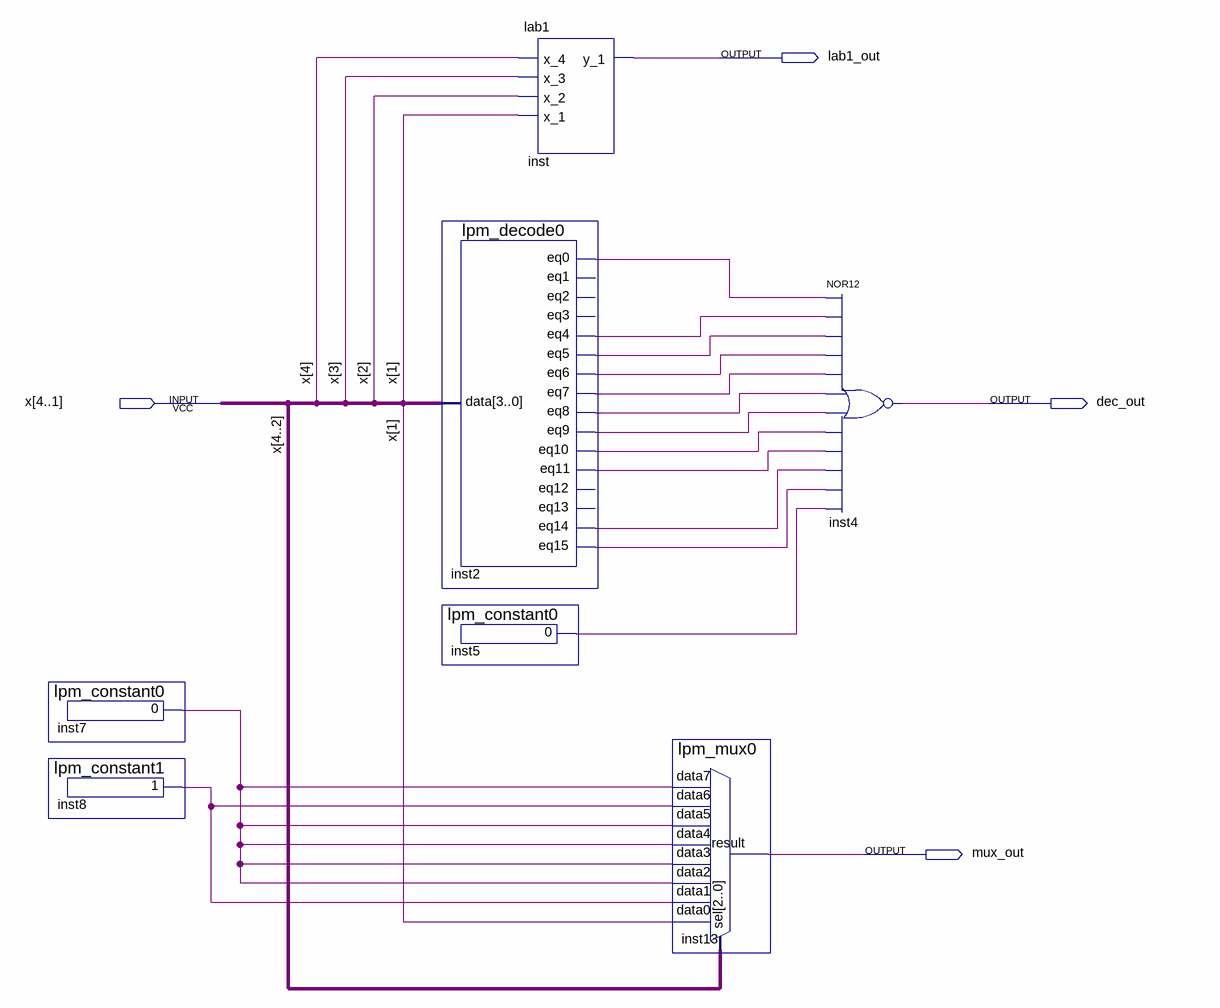
[diagram p0: schematic sheet]
// Quartus schematic lab2_1.bdf as structural Verilog: 7 symbols, 4 pins
module lab2_1 (
  input  [4:1] x,
  output lab1_out,
  output dec_out,
  output mux_out
);

  wire inst2_eq0, inst2_eq4, inst2_eq5, inst2_eq6, inst2_eq7, inst2_eq8, inst2_eq9, inst2_eq10, inst2_eq11,
       inst2_eq14, inst2_eq15, inst5_result, inst7_result, inst8_result;

  lpm_constant0 inst7 (.result(inst7_result));
  lpm_constant1 inst8 (.result(inst8_result));
  lpm_decode0 inst2 (
    .data(x), .eq0(inst2_eq0), .eq4(inst2_eq4), .eq5(inst2_eq5), .eq6(inst2_eq6), .eq7(inst2_eq7),
    .eq8(inst2_eq8), .eq9(inst2_eq9), .eq10(inst2_eq10), .eq11(inst2_eq11), .eq14(inst2_eq14),
    .eq15(inst2_eq15));  // open: eq1, eq2, eq3, eq12, eq13
  lpm_constant0 inst5 (.result(inst5_result));
  lab1 inst (.x_4(x[4]), .x_3(x[3]), .x_2(x[2]), .x_1(x[1]), .y_1(lab1_out));
  lpm_mux0 inst13 (
    .data7(inst7_result), .data6(inst8_result), .data5(inst7_result), .data4(inst7_result),
    .data3(inst7_result), .data2(inst7_result), .data1(inst8_result), .data0(x[1]), .sel(x[4:2]),
    .result(mux_out));
  nor inst4 (dec_out, inst2_eq0, inst2_eq4, inst2_eq5, inst2_eq6, inst2_eq7, inst2_eq8, inst2_eq9, inst2_eq10, inst2_eq11, inst2_eq14, inst2_eq15, inst5_result);
endmodule
